# Altium schematic sheet Microphone.SchDoc
size A4; SheetNumber: 3; SheetTotal: 6
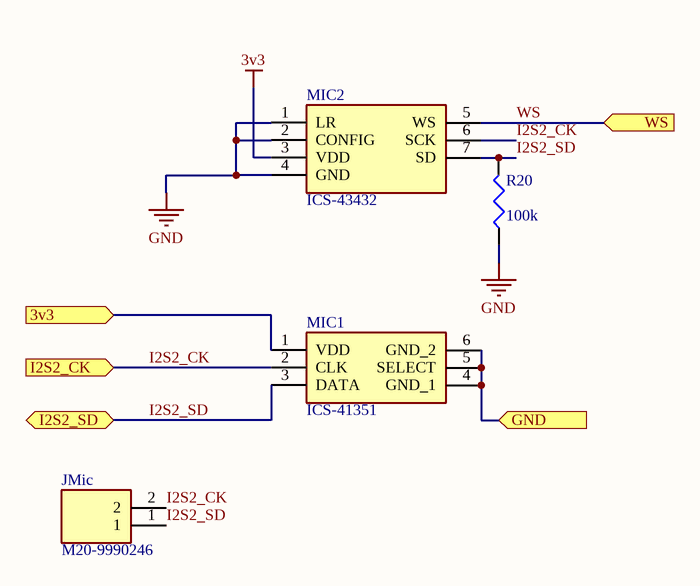
[diagram p0: Microphone.SchDoc]

## Parts
JMic  M20-9990246  [HDRV2W66P0X254_1X2_508X254X874P]
MIC1  ICS-41351  [ICS41351]
MIC2  ICS-43432  [ICS43432]
R20  value 100k  [J1-0603]  (hidden comment: Res3)

## Ports
3v3 (in), GND (in), I2S2_CK (in), I2S2_SD (bidir), WS (in)

## Nets
3v3: MIC2.3(VDD)
GND: MIC2.1(LR) MIC2.2(CONFIG) MIC2.4(GND) R20.1
3v3: MIC1.1(VDD) ; port 3v3  [a separate net that carries the same name]
GND: MIC1.4(GND_1) MIC1.5(SELECT) MIC1.6(GND_2) ; port GND  [a separate net that carries the same name]
I2S2_CK: JMic.2 MIC1.2(CLK) MIC2.6(SCK) ; port I2S2_CK
I2S2_SD: JMic.1 MIC1.3(DATA) MIC2.7(SD) R20.2 ; port I2S2_SD
WS: MIC2.5(WS) ; port WS

## Library data of the parts
JMic = M20-9990246: Connector; Manufacturer_Name: Harwin; Datasheet Link: https://cdn.harwin.com/pdfs/M20-999.pdf; Height: 8.74mm; Manufacturer_Part_Number: M20-9990246; Mouser Part Number: 855-M20-9990246; Mouser Price/Stock: https://www.mouser.co.uk/ProductDetail/Harwin/M20-9990246?qs=Jph8NoUxIfWjw4WmyRvzag%3D%3D
MIC1 = ICS-41351: Microphone; Manufacturer_Name: TDK; Datasheet Link: https://product.tdk.com/system/files/dam/doc/product/sw_piezo/mic/mems-mic/data_sheet/ds-000157-ics-41351-v1.1.pdf; Height: 1.08mm; Manufacturer_Part_Number: ICS-41351; Mouser Part Number: 410-ICS-41351; Mouser Price/Stock: https://www.mouser.co.uk/ProductDetail/TDK-InvenSense/ICS-41351?qs=%252B6g0mu59x7LDJ1mBnROZzA%3D%3D; Arrow Part Number: ICS-41351; Arrow Price/Stock: https://www.arrow.com/en/products/ics-41351/invensense
MIC2 = ICS-43432: Integrated Circuit; Manufacturer_Name: TDK; Datasheet Link: https://product.tdk.com/system/files/dam/doc/product/sw_piezo/mic/mems-mic/data_sheet/ics-43432-data-sheet-v1.3.pdf; Height: 1.1mm; Manufacturer_Part_Number: ICS-43432; Mouser Part Number: 410-ICS-43432; Mouser Price/Stock: https://www.mouser.co.uk/ProductDetail/TDK-InvenSense/ICS-43432?qs=u4fy%2FsgLU9PhEy4uYlgedw%3D%3D; Arrow Part Number: ICS-43432; Arrow Price/Stock: https://www.arrow.com/en/products/ics-43432/invensense?region=nac
R20 = Res3: Resistor; Published: 8-Jun-2000; LatestRevisionDate: 29-May-2009; LatestRevisionNote: IPC-7351 Footprint Added.; PackageReference: J1-0603; Publisher: Altium Limited; PackageDescription: Chip Resistor